# Altium schematic sheet USB_Ethernet.SchDoc: USB & Ethernet
size A4; DrawnBy: Patrik Staudenmayer; DocumentNumber: 5; SheetNumber: 5; SheetTotal: 15
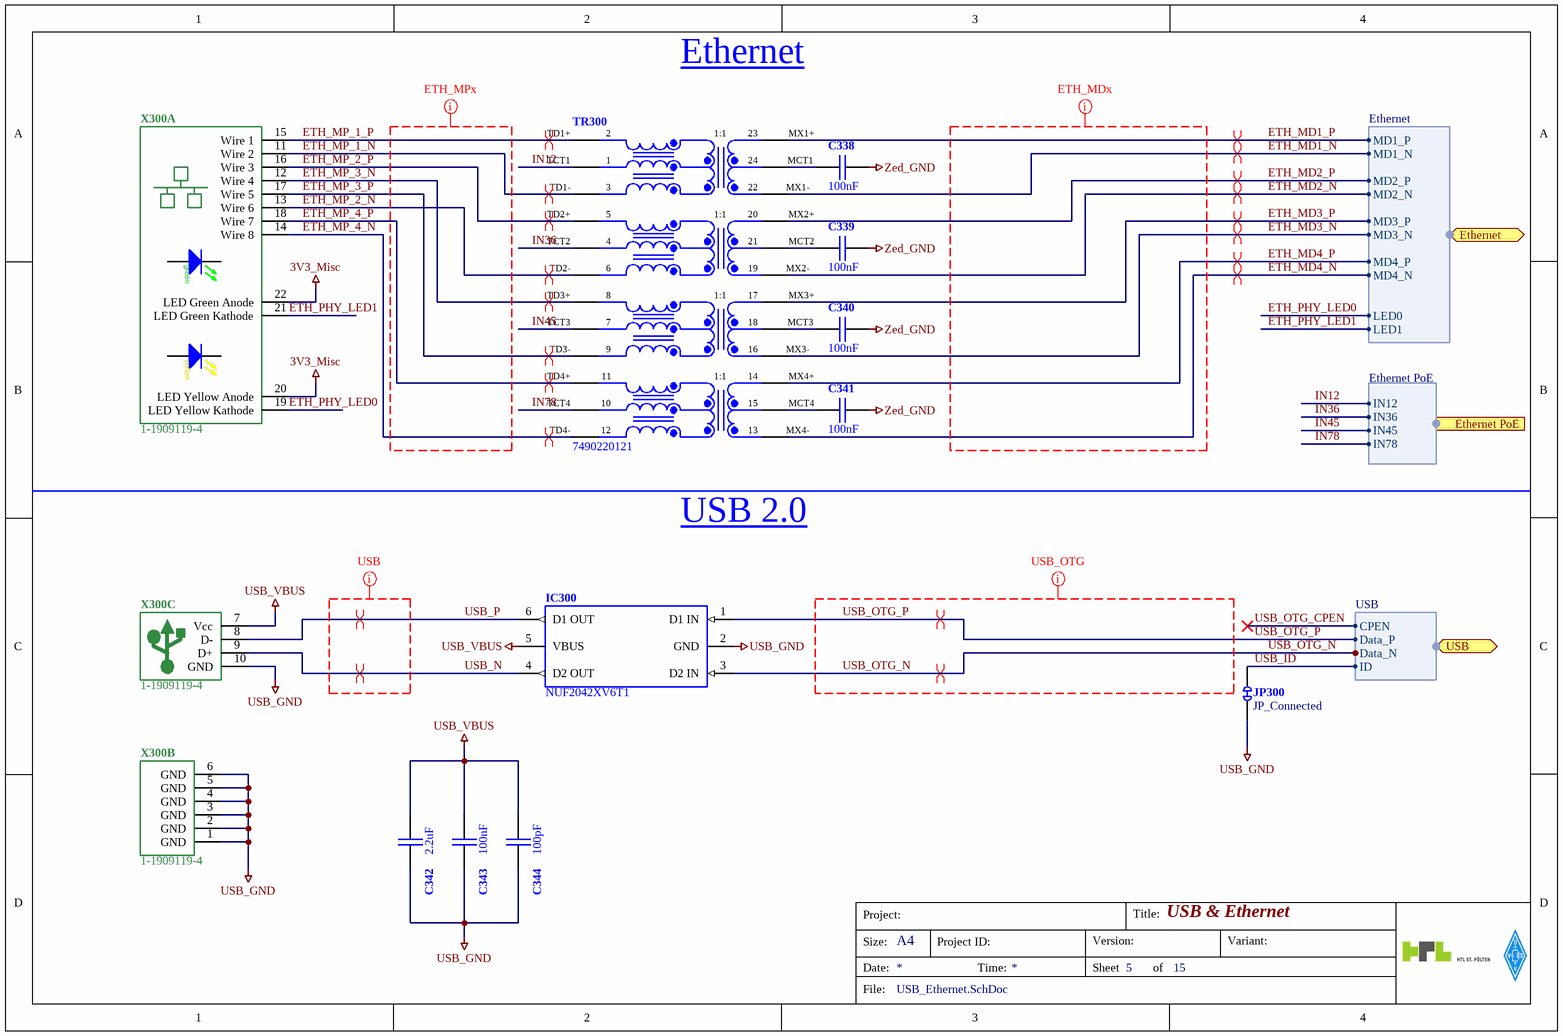
[diagram p0: USB_Ethernet.SchDoc]

## Parts
C338  100nF  [C_0603_N [CAPC1608N IPC]]
C339  100nF  [C_0603_N [CAPC1608N IPC]]
C340  100nF  [C_0603_N [CAPC1608N IPC]]
C341  100nF  [C_0603_N [CAPC1608N IPC]]
C342  2.2uF  [C_1210_N [CAPC3225N IPC]]
C343  100nF  [C_0805_N [CAPC2013N IPC]]
C344  100pF  [C_0603_N [CAPC1608N IPC]]
IC300  NUF2042XV6T1  [SOTFL50P160X60-6N IPC]
JP300  JP_Connected  [JP_Connected]  (no BOM)
TR300  7490220121  [TR_7490220121]
X300  1-1909119-4  [X_1-1909119-4]  (parts A,B,C of 3)

## Ports
Ethernet (bidir, harness Ethernet), Ethernet PoE (harness Ethernet PoE), USB (bidir, harness USB)

## Harnesses
Ethernet: LED0, LED1, MD1_P, MD1_N, MD2_P, MD2_N, MD3_P, MD3_N, MD4_P, MD4_N
Ethernet PoE: IN12, IN36, IN45, IN78
USB: ID, Data_P, Data_N, CPEN

## Nets
3V3_Misc: X300.20(LED_Yellow_Anode) X300.22(LED_Green_Anode)
USB_GND: C342.2 C343.2 C344.2 IC300.2(GND) JP300.2(-) X300.1(GND) X300.2(GND) X300.3(GND) X300.4(GND) X300.5(GND) X300.6(GND) X300.10(GND)
USB_VBUS: C342.1 C343.1 C344.1 IC300.5(VBUS) X300.7(Vcc)
Zed_GND: C338.2 C339.2 C340.2 C341.2
ETH_MD1_N: TR300.22(MX1-) ; port Ethernet.MD1_N
ETH_MD1_P: TR300.23(MX1+) ; port Ethernet.MD1_P
ETH_MD2_N: TR300.19(MX2-) ; port Ethernet.MD2_N
ETH_MD2_P: TR300.20(MX2+) ; port Ethernet.MD2_P
ETH_MD3_N: TR300.16(MX3-) ; port Ethernet.MD3_N
ETH_MD3_P: TR300.17(MX3+) ; port Ethernet.MD3_P
ETH_MD4_N: TR300.13(MX4-) ; port Ethernet.MD4_N
ETH_MD4_P: TR300.14(MX4+) ; port Ethernet.MD4_P
ETH_MP_1_N: TR300.3(TD1-) X300.11(Wire_2)
ETH_MP_1_P: TR300.2(TD1+) X300.15(Wire_1)
ETH_MP_2_N: TR300.6(TD2-) X300.13(Wire_6)
ETH_MP_2_P: TR300.5(TD2+) X300.16(Wire_3)
ETH_MP_3_N: TR300.8(TD3+) X300.12(Wire_4)
ETH_MP_3_P: TR300.9(TD3-) X300.17(Wire_5)
ETH_MP_4_N: TR300.12(TD4-) X300.14(Wire_8)
ETH_MP_4_P: TR300.11(TD4+) X300.18(Wire_7)
ETH_PHY_LED0: X300.19(LED_Yellow_Kathode) ; port Ethernet.LED0
ETH_PHY_LED1: X300.21(LED_Green_Kathode) ; port Ethernet.LED1
IN12: TR300.1(TCT1) ; port Ethernet PoE.IN12
IN36: TR300.4(TCT2) ; port Ethernet PoE.IN36
IN45: TR300.7(TCT3) ; port Ethernet PoE.IN45
IN78: TR300.10(TCT4) ; port Ethernet PoE.IN78
USB_ID: JP300.1(+) ; port USB.ID
USB_N: IC300.4(D2_OUT) X300.9(D+)
USB_OTG_CPEN: port USB.CPEN
USB_OTG_N: IC300.3(D2_IN) ; port USB.Data_N
USB_OTG_P: IC300.1(D1_IN) ; port USB.Data_P
USB_P: IC300.6(D1_OUT) X300.8(D-)
NetC338_1: C338.1 TR300.24(MCT1)
NetC339_1: C339.1 TR300.21(MCT2)
NetC340_1: C340.1 TR300.18(MCT3)
NetC341_1: C341.1 TR300.15(MCT4)

## Layout directives
differential pair: ETH_MD1_N, ETH_MD1_P, ETH_MD2_N, ETH_MD2_P, ETH_MD3_N, ETH_MD3_P, ETH_MD4_N, ETH_MD4_P, ETH_MP_1_N, ETH_MP_1_P, ETH_MP_2_N, ETH_MP_2_P, ETH_MP_3_N, ETH_MP_3_P, ETH_MP_4_N, ETH_MP_4_P, USB_N, USB_OTG_N, USB_OTG_P, USB_P
net class ETH_MDx; rule Matched Net Lengths [Tolerance = 25mil]; rule Maximum Via Count Constraint [Max Count = 2]; rule Differential Pairs Routing [Pref Gap = 5mil    Min Gap  = 5mil    Max Gap  = 5milPref Width = 4.138mil    Min Width  = 2.925mil    Max Width  = 4.138mil]: (no net found under the mark)
net class ETH_MPx; rule Matched Net Lengths [Tolerance = 25mil]; rule Maximum Via Count Constraint [Max Count = 2]; rule Differential Pairs Routing [Pref Gap = 5mil    Min Gap  = 5mil    Max Gap  = 5milPref Width = 4.138mil    Min Width  = 2.925mil    Max Width  = 4.138mil]: (no net found under the mark)
net class USB; rule Differential Pairs Routing [Pref Gap = 5mil    Min Gap  = 5mil    Max Gap  = 5milPref Width = 5.458mil    Min Width  = 3.981mil    Max Width  = 5.458mil]; rule Matched Net Lengths [Tolerance = 25mil]; rule Maximum Via Count Constraint [Max Count = 2]: (no net found under the mark)
net class USB_OTG; rule Differential Pairs Routing [Pref Gap = 5mil    Min Gap  = 5mil    Max Gap  = 5milPref Width = 5.458mil    Min Width  = 3.981mil    Max Width  = 5.458mil]; rule Matched Net Lengths [Tolerance = 25mil]; rule Maximum Via Count Constraint [Max Count = 2]: USB_OTG_N, USB_OTG_P

## Notes on the sheet
- Ethernet
- USB 2.0
- Project:
- Title:
- Size:
- Date:
- A4
- Project ID:
- Time:
- Sheet
- Version:
- of
- Variant:
- File:
- (in symbol TR_7490220121) 1:1
- (in symbol X_1-1909119-4, part A) green; yellow

## Library data of the parts
C338-C344 = C_GENERIC: Prometheus_ID: *; Prometheus_Manufacturer: *
  C338-C341: Prometheus_ManPartNo: 100nF; Prometheus_Comment: 100nF; Prometheus_CurrentFootprint: C_0603_N [CAPC1608N IPC]
  C342: Prometheus_ManPartNo: 2.2uF; Prometheus_Comment: 2.2uF; Prometheus_CurrentFootprint: C_1210_N [CAPC3225N IPC]
  C343: Prometheus_ManPartNo: 100nF; Prometheus_Comment: 100nF; Prometheus_CurrentFootprint: C_0805_N [CAPC2013N IPC]
  C344: Prometheus_ManPartNo: 100pF; Prometheus_Comment: 100pF; Prometheus_CurrentFootprint: C_0603_N [CAPC1608N IPC]
IC300 = IC_NUF2042XV6T1: USB Upstream Terminator with ESD Protection / Compliance with IEC61000-4-2 (Level 4) / 8 kV (Contact) / 15 kV (Air) / ESD Ratings: / Machine Model = C / Human Body Model = 3B; Prometheus_Manufacturer: ON Semiconductor; Prometheus_ManPartNo: NUF2042XV6T1; Prometheus_Comment: NUF2042XV6T1; Prometheus_CurrentFootprint: SOTFL50P160X60-6N IPC
TR300 = TR_7490220121: Operating temperature: -40°C - +105°C / 1000BaseT according to IEEE 802.3bt / for 4PPoE / 600 mA per center tap / 30 W when using two channels / 60 W when using four channels; Prometheus_Manufacturer: Wuerth; Prometheus_ID: *; Prometheus_ManPartNo: 7490220121; Prometheus_Comment: 7490220121; Prometheus_CurrentFootprint: TR_7490220121
X300 = X_1-1909119-4: Combo Jack RJ45 + USB / Green and Yellow Led; Prometheus_Manufacturer: TE Connectivity; Prometheus_ID: *; Prometheus_ManPartNo: 1-1909119-4; Prometheus_Comment: 1-1909119-4; Prometheus_CurrentFootprint: X_1-1909119-4
JP300 = JP_Connected: Prometheus_ID: *; Prometheus_ManPartNo: JP_Connected; Prometheus_Manufacturer: *; Prometheus_Comment: JP_Connected; Prometheus_CurrentFootprint: JP_Connected